# EAGLE design Pomodoro (EAGLE 6.5.0)
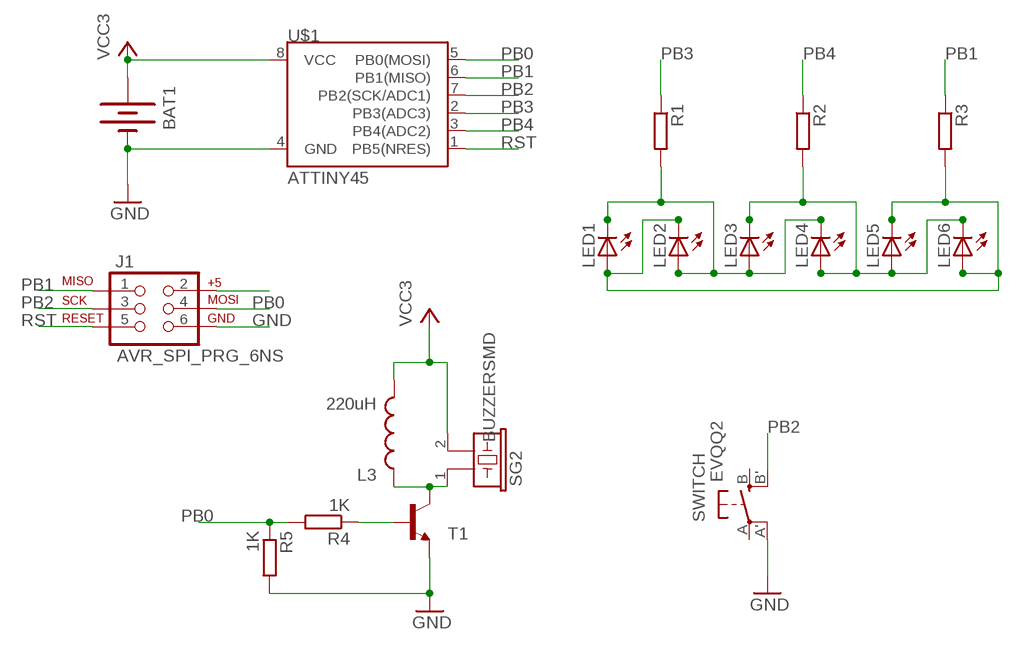
[diagram p0: schematic, sheet 1]

## Parts
BAT1  BATTERY20SMD  [BATTCON_20MM]
J1  AVR_SPI_PRG_6NS  [2X3-NS]
L3  220uH  INDUCTOR1007  [1007]
LED1  LEDCHIPLED_0805  [CHIPLED_0805]
LED2  LEDCHIPLED_0805  [CHIPLED_0805]
LED3  LEDCHIPLED_0805  [CHIPLED_0805]
LED4  LEDCHIPLED_0805  [CHIPLED_0805]
LED5  LEDCHIPLED_0805  [CHIPLED_0805]
LED6  LEDCHIPLED_0805  [CHIPLED_0805]
R1  R-EU_R0805  [R0805]
R2  R-EU_R0805  [R0805]
R3  R-EU_R0805  [R0805]
R4  1K  R-EU_R0805  [R0805]
R5  1K  R-EU_R0805  [R0805]
SG2  BUZZERSMD  [KOBITONE-254-PB501-ROX]
SWITCH  EVQQ2  [EVQ-Q2]
T1  BC849-NPN-SOT23-BEC  [SOT23-BEC]
U$1  ATTINY45  [SO08-EIAJ]

## Nets
GND: BAT1.2(-) J1.6 R5.2 SWITCH.A'(P1) T1.E U$1.4(GND)
N$1: R4.1 T1.B
N$5: LED1.C LED2.A LED3.A LED4.C R1.2
N$6: J1.2
N$7: L3.1 SG2.1 T1.C
N$10: LED3.C LED4.A LED5.A LED6.C R2.2
N$14: LED1.A LED2.C LED5.C LED6.A R3.2
PB0: J1.4 R4.2 R5.1 U$1.5(PB0(MOSI))
PB1: J1.1 R3.1 U$1.6(PB1(MISO))
PB2: J1.3 SWITCH.B'(S1) U$1.7(PB2(SCK/ADC1))
PB3: R1.1 U$1.2(PB3(ADC3))
PB4: R2.1 U$1.3(PB4(ADC2))
RST: J1.5 U$1.1(PB5(NRES))
VCC3: BAT1.1(+) BAT1.3(+) L3.2 SG2.2 U$1.8(VCC)
Unconnected: SWITCH.A(P) SWITCH.B(S)

## Library data of the parts
BAT1 = Robin:BATTERY: Battery Holders Various common sizes : AA, AAA, 20mm coin cell and 12mm coin cell.
J1 = SparkFun:AVR_SPI_PRG_6: AVR ISP 6 Pin This is the reduced ISP connector for AVR programming. Common on Arduino. This footprint will take up less PCB space and can be used with a 10-pin to 6-pin adapter such as SKU: BOB-08508
L3 = SparkFun:INDUCTOR: Inductors Basic Inductor/Choke - 0603 and 1206. Footprints are not proven and vary greatly between part numbers.
LED1-LED6 = led:LED: LED OSRAM: - CHIPLED LG R971, LG N971, LY N971, LG Q971, LY Q971, LO R971, LY R971 LH N974, LH R974 LS Q976, LO Q976, LY Q976 LO Q996 - Hyper CHIPLED LW Q18S LB Q993, LB Q99A, LB R99A - SideLED LS A670, LO A670, LY A670, LG A670, LP A670 LB A673, LV A673, LT A673, LW A673 LH A674 LY A675 LS A676, LA A676, LO A676, LY A676, LW A676 LS A679, LY A679, LG A679 - Hyper Micro SIDELED® LS Y876, LA Y876, LO Y876, LY Y876 LT Y87S - SmartLED LW L88C, LW L88S LB L89C, LB L89S, LG L890 LS L89K, LO L89K, LY L89K LS L896, LA L896, LO L896, LY L896 - TOPLED LS T670, LO T670, LY T670, LG T670, LP T670 LSG T670, LSP T670, LSY T670, LOP T670, LYG T670 LG T671, LOG T671, LSG T671 LB T673, LV T673, LT T673, LW T673 LH T674 LS T676, LA T676, LO T676, LY T676, LB T676, LH T676, LSB T676, LW T676 LB T67C, LV T67C, LT T67C, LS T67K, LO T67K, LY T67K, LW E67C LS E67B, LA E67B, LO E67B, LY E67B, LB E67C, LV E67C, LT E67C LW T67C LS T679, LY T679, LG T679 LS T770, LO T770, LY T770, LG T770, LP T770 LB T773, LV T773, LT T773, LW T773 LH T774 LS E675, LA E675, LY E675, LS T675 LS T776, LA T776, LO T776, LY T776, LB T776 LHGB T686 LT T68C, LB T68C - Hyper Mini TOPLED® LB M676 - Mini TOPLED Santana® LG M470 LS M47K, LO M47K, LY M47K Source: http://www.osram.convergy.de LUXEON: - LUMILED® LXK2-PW12-R00, LXK2-PW12-S00, LXK2-PW14-U00, LXK2-PW14-V00 LXK2-PM12-R00, LXK2-PM12-S00, LXK2-PM14-U00 LXK2-PE12-Q00, LXK2-PE12-R00, LXK2-PE12-S00, LXK2-PE14-T00, LXK2-PE14-U00 LXK2-PB12-K00, LXK2-PB12-L00, LXK2-PB12-M00, LXK2-PB14-N00, LXK2-PB14-P00, LXK2-PB14-Q00 LXK2-PR12-L00, LXK2-PR12-M00, LXK2-PR14-Q00, LXK2-PR14-R00 LXK2-PD12-Q00, LXK2-PD12-R00, LXK2-PD12-S00 LXK2-PH12-R00, LXK2-PH12-S00 LXK2-PL12-P00, LXK2-PL12-Q00, LXK2-PL12-R00 Source: www.luxeon.com KINGBRIGHT: KA-3528ASYC Source: www.kingbright.com
R1-R5 = rcl:R-EU_: RESISTOR, European symbol
SG2 = Robin:BUZZER: BUZZER Source: muRata
SWITCH = adafruit:EVQQ2: SMT 6mm switch, EVQQ2 series http://www.ladyada.net/library/eagle
T1 = transistor:*-NPN-: NPN Transistror BF959 corrected 2008.03.06
U$1 = SparkFun:ATTINY45: Atmel ATTiny45

## Board
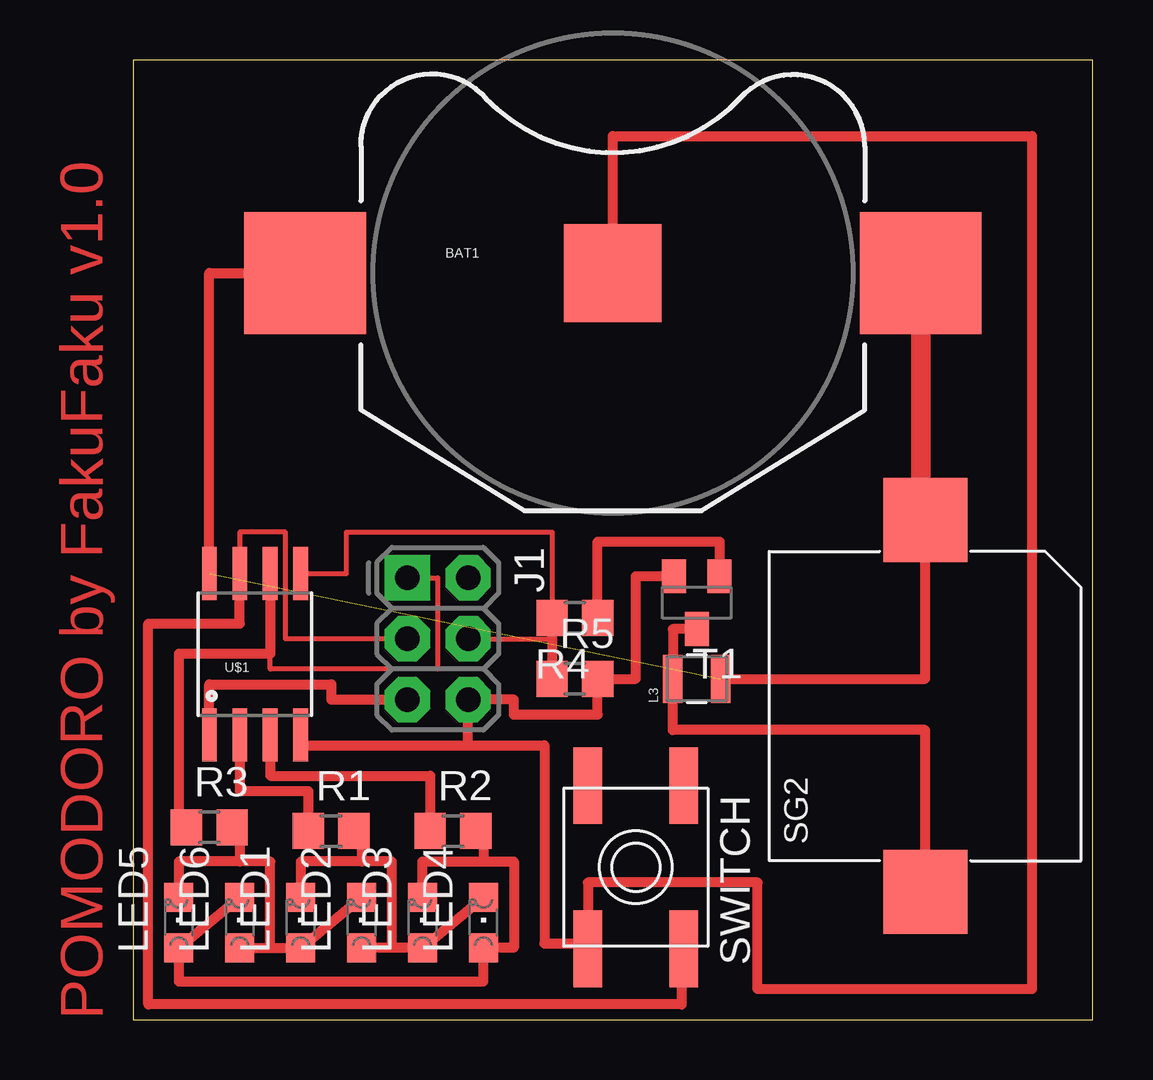
[diagram p1: board, top side]

Size 40 x 40 mm. Coordinates in mm from the lower left corner, seen from the top.
Outline: 0,0 40,0 40,40 0,40 0,0
Copper layers (1*16): Top 0.035mm / dielectric 1.5mm / Bottom 0.035mm
Design rules "default": minimum track width 10mil, minimum drill 24mil, track to track 8mil, track to pad 8mil, pad to pad 8mil, via to via 8mil, smd to smd 8mil, copper to edge 40mil, drill to drill 8mil, minimum pad ring 10mil, minimum via ring 8mil, stop-mask expansion 4mil, vias tented up to drill 0mil, thermal gap 10mil

### Footprints (pad centres in the part's own frame; a part is rotated, then mirrored left to right if it is on the bottom)
BATTCON_20MM = smd 5.08 x 5.08: 1 -12.827,0; 3 12.827,0 | smd 4.064 x 4.064: 2 0,0
2X3-NS = drill 1.016 pad 1.88 square: 1 -2.54,-1.27 | drill 1.016 pad 1.88 octagon: 2 -2.54,1.27; 3 0,-1.27; 4 0,1.27; 5 2.54,-1.27; 6 2.54,1.27
1007 = smd 2 x 0.8: 1 0,1; 2 0,-1
CHIPLED_0805 = smd 1.2 x 1.2: A 0,-1.05; C 0,1.05
R0805 = smd 1.3 x 1.5: 1 -0.95,0; 2 0.95,0
KOBITONE-254-PB501-ROX = smd 3.5 x 3.5: 1 0,0; 2 15.5,0
EVQ-Q2 = smd 3.2 x 1.2: A -3.4,-2; A' 3.4,-2; B -3.4,2; B' 3.4,2
SOT23-BEC = smd 1 x 1.4: B -0.95,-1.1; C 0,1.1; E 0.95,-1.1
SO08-EIAJ = smd 0.61 x 2.21: 1 -1.905,-3.378; 2 -0.635,-3.378; 3 0.635,-3.378; 4 1.905,-3.378; 5 1.905,3.353; 6 0.635,3.353; 7 -0.635,3.353; 8 -1.905,3.353

### Placement (x,y rotation side)
BAT1  20,31.11 0 top
J1  12.7,15.88 270 top
L3  23.5,14.21 90 top
LED1  6.99,4.04 0 top
LED2  9.53,4.04 0 top
LED3  12.06,4.04 0 top
LED4  14.61,4.04 0 top
LED5  1.91,4.04 0 top
LED6  4.45,4.04 0 top
R1  8.26,7.86 0 top
R2  13.34,7.86 0 top
R3  3.17,8.02 0 top
R4  18.41,16.75 180 top
R5  18.41,14.21 0 top
SG2  33.02,5.32 90 top
SWITCH  20.95,6.35 270 top
T1  23.5,17.38 180 top
U$1  5.08,15.24 0 top

### Tracks (layer width: path | path; a pad name or v marks a point on that pad's centre or on a via)
GND
  Top 0.406: T1.E 20.95,18.48 20.95,14.21 R5.2 19.36,12.7 15.88,12.7 15.88,13.34 J1.6 13.97,11.43 | U$1.4 6.99,11.43 13.97,11.43 | 13.97,11.43 17.14,11.43 17.14,3.17 18.95,3.17 SWITCH.A' 18.95,5.71 26.04,5.71 26.04,1.27 37.47,1.27 37.47,36.83 20,36.83 BAT1.2
N$1
  Top 0.406: R4.1 19.36,19.92 24.45,19.92 T1.B
N$5
  Top 0.406: LED4.C LED3.A 10.79,3 | 10.79,3 10.79,6.58 9.53,6.58 | 9.53,6.58 6.99,6.58 LED1.C | 10.79,3 LED2.A | R1.2 9.53,7.86 9.53,6.58
N$7
  Top 0.406: T1.C 22.5,16.28 L3.1 22.5,12.06 33.02,12.06 SG2.1
N$10
  Top 0.406: LED3.C 12.06,6.58 14.61,6.58 | 14.61,6.58 15.88,6.58 15.88,3 LED4.A 14.61,1.59 1.91,1.59 LED5.A LED6.C | R2.2 14.61,7.86 14.61,6.58
N$14
  Top 0.406: LED2.C LED1.A 5.71,3 | LED6.A 5.71,3 | 5.71,3 5.71,6.58 4.45,6.58 | 4.45,6.58 1.91,6.58 LED5.C | R3.2 4.45,8.02 4.45,6.58
PB0
  Top 0.203: U$1.5 8.89,18.59 8.89,20.32 17.46,20.32 R4.2 | J1.4 17.46,15.88
  Top 0.406: R4.2 17.46,15.88 R5.1
PB1
  Top 0.203: J1.1 12.7,18.41 12.7,14.61 5.71,14.61 5.71,15.24
  Top 0.406: U$1.6 5.71,15.24 1.91,15.24 1.91,8.02 R3.1
PB2
  Top 0.203: J1.3 6.35,15.88 6.35,20.32 4.45,20.32 U$1.7
  Top 0.406: SWITCH.B' 22.86,2.95 22.86,0.64 0.64,0.64 0.64,16.51 4.45,16.51 U$1.7
PB3
  Top 0.406: U$1.2 4.45,9.53 7.3,9.53 R1.1
PB4
  Top 0.406: U$1.3 5.71,10.16 12.38,10.16 R2.1
RST
  Top 0.406: U$1.1 3.17,13.97 8.26,13.97 8.26,13.34 J1.5
VCC3  (1 unrouted)
  Top 0.406: SG2.2 33.02,14.21 L3.2 | U$1.8 3.17,31.11 BAT1.1
  Top 0.813: SG2.2 32.83,20.82 BAT1.3

### Text on the board
Top: POMODORO by FakuFaku v1.0